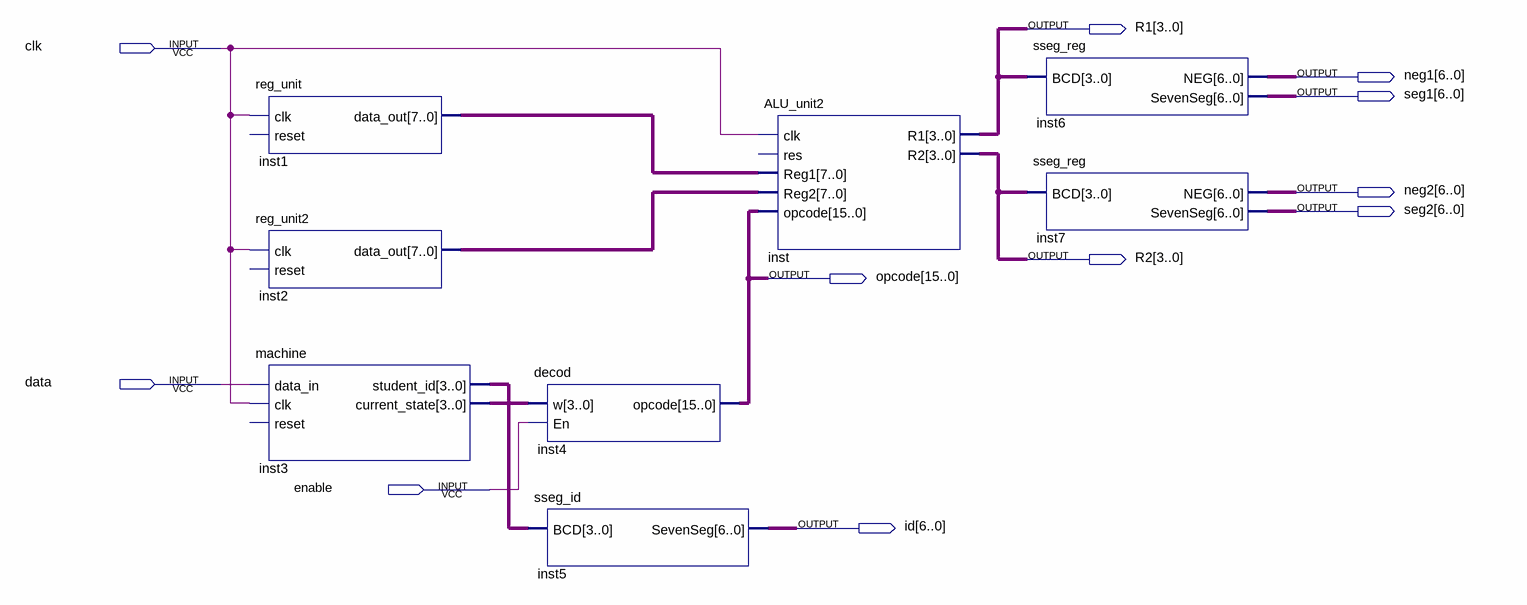
[diagram p0: schematic sheet]
// Quartus schematic PROBLEM_2.bdf as structural Verilog: 8 symbols, 11 pins
module PROBLEM_2 (
  input  clk,
  input  data,
  input  enable,
  output [3:0] R1,
  output [6:0] neg1,
  output [6:0] seg1,
  output [6:0] neg2,
  output [6:0] seg2,
  output [3:0] R2,
  output [15:0] opcode,
  output [6:0] id
);

  wire [3:0] inst3_current_state, inst3_student_id;
  wire [7:0] inst1_data_out, inst2_data_out;

  reg_unit inst1 (.clk(clk), .data_out(inst1_data_out));  // open: reset
  reg_unit2 inst2 (.clk(clk), .data_out(inst2_data_out));  // open: reset
  machine inst3 (
    .data_in(data), .clk(clk), .student_id(inst3_student_id), .current_state(inst3_current_state));  // open: reset
  decod inst4 (.w(inst3_current_state), .En(enable), .opcode(opcode));
  sseg_id inst5 (.BCD(inst3_student_id), .SevenSeg(id));
  ALU_unit2 inst (
    .clk(clk), .Reg1(inst1_data_out), .Reg2(inst2_data_out), .opcode(opcode), .R1(R1), .R2(R2));  // open: res
  sseg_reg inst6 (.BCD(R1), .NEG(neg1), .SevenSeg(seg1));
  sseg_reg inst7 (.BCD(R2), .NEG(neg2), .SevenSeg(seg2));
endmodule
